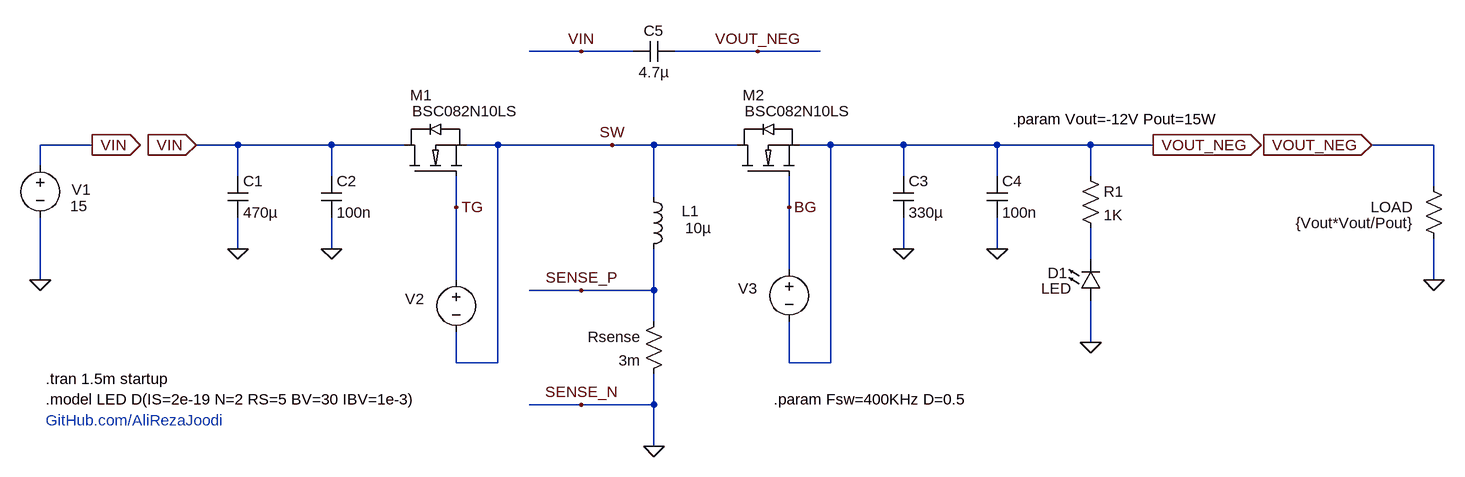
[diagram p0: schematic _PowerStage_v2.0.asc]
_PowerStage_v2.0.asc, the LTspice schematic file:
Version 4.1
SHEET 1 4548 1504
WIRE 3104 176 3024 176
WIRE 3184 176 3104 176
WIRE 3376 176 3248 176
WIRE 3472 176 3376 176
WIRE 2352 320 2272 320
WIRE 2576 320 2512 320
WIRE 2720 320 2576 320
WIRE 2832 320 2720 320
WIRE 2976 320 2928 320
WIRE 3152 320 2976 320
WIRE 3216 320 3152 320
WIRE 3344 320 3216 320
WIRE 3488 320 3440 320
WIRE 3600 320 3488 320
WIRE 3744 320 3600 320
WIRE 3888 320 3744 320
WIRE 3984 320 3888 320
WIRE 4416 320 4320 320
WIRE 2272 352 2272 320
WIRE 2576 368 2576 320
WIRE 2720 368 2720 320
WIRE 3600 368 3600 320
WIRE 3744 368 3744 320
WIRE 3888 368 3888 320
WIRE 4416 384 4416 320
WIRE 3216 400 3216 320
WIRE 2912 416 2912 368
WIRE 3424 416 3424 368
WIRE 2576 480 2576 432
WIRE 2720 480 2720 432
WIRE 3600 480 3600 432
WIRE 3744 480 3744 432
WIRE 3888 496 3888 448
WIRE 3424 512 3424 416
WIRE 2272 528 2272 432
WIRE 2912 528 2912 416
WIRE 4416 528 4416 464
WIRE 3104 544 3024 544
WIRE 3216 544 3216 480
WIRE 3216 544 3104 544
WIRE 3216 592 3216 544
WIRE 3888 624 3888 560
WIRE 2912 656 2912 608
WIRE 2976 656 2976 320
WIRE 2976 656 2912 656
WIRE 3424 656 3424 592
WIRE 3488 656 3488 320
WIRE 3488 656 3424 656
WIRE 3104 720 3024 720
WIRE 3216 720 3216 672
WIRE 3216 720 3104 720
WIRE 3216 784 3216 720
FLAG 3984 320 VOUT_NEG
IOPIN 3984 320 Out
FLAG 2352 320 VIN
IOPIN 2352 320 Out
FLAG 3152 320 SW
FLAG 2912 416 TG
FLAG 3104 544 SENSE_P
FLAG 3104 720 SENSE_N
FLAG 2512 320 VIN
IOPIN 2512 320 In
FLAG 4320 320 VOUT_NEG
IOPIN 4320 320 In
FLAG 3424 416 BG
FLAG 2272 528 0
FLAG 2576 480 0
FLAG 2720 480 0
FLAG 3216 784 0
FLAG 3600 480 0
FLAG 3744 480 0
FLAG 3888 624 0
FLAG 4416 528 0
FLAG 3376 176 VOUT_NEG
FLAG 3104 176 VIN
SYMBOL ind 3200 384 R0
WINDOW 0 59 38 Left 2
WINDOW 3 64 64 Left 2
SYMATTR InstName L1
SYMATTR Value 10µ
SYMATTR SpiceLine Rser=10m
SYMBOL res 3232 576 M0
SYMATTR InstName Rsense
SYMATTR Value 3m
SYMATTR SpiceLine tol=1
SYMBOL voltage 2272 336 R0
WINDOW 123 24 138 Left 2
WINDOW 39 24 117 Left 2
WINDOW 3 46 78 Left 2
WINDOW 0 48 53 Left 2
SYMATTR Value 15
SYMATTR InstName V1
SYMBOL res 4432 480 R180
WINDOW 0 48 64 Left 2
WINDOW 3 48 40 Left 2
SYMATTR InstName LOAD
SYMATTR Value {Vout*Vout/Pout}
SYMBOL cap 2704 368 R0
SYMATTR InstName C2
SYMATTR Value 100n
SYMATTR SpiceLine V=35
SYMBOL cap 3728 368 R0
SYMATTR InstName C4
SYMATTR Value 100n
SYMBOL LED 3872 560 M180
WINDOW 0 -50 43 Left 2
WINDOW 3 -60 19 Left 2
SYMATTR InstName D1
SYMATTR Value LED
SYMBOL res 3872 352 R0
SYMATTR InstName R1
SYMATTR Value 1K
SYMBOL cap 2560 368 R0
SYMATTR InstName C1
SYMATTR Value 470µ
SYMATTR SpiceLine V=35
SYMBOL cap 3584 368 R0
SYMATTR InstName C3
SYMATTR Value 330µ
SYMATTR SpiceLine V=35
SYMBOL MyLib\\Transistor_MOSFET_N\\MOSFET_N 2832 368 R270
WINDOW 0 125 9 VRight 2
WINDOW 3 100 12 VRight 2
SYMATTR InstName M1
SYMATTR Value BSC082N10LS
SYMBOL MyLib\\Transistor_MOSFET_N\\MOSFET_N 3344 368 R270
WINDOW 0 125 9 VRight 2
WINDOW 3 100 12 VRight 2
SYMATTR InstName M2
SYMATTR Value BSC082N10LS
SYMBOL voltage 2912 512 M0
WINDOW 3 39 69 Invisible 2
WINDOW 123 0 0 Left 0
WINDOW 0 49 45 Left 2
SYMATTR Value PULSE(0 12 0 {0.01/Fsw} {0.01/Fsw} {D/Fsw} {1/Fsw})
SYMATTR InstName V2
SYMATTR SpiceLine Rser=10
SYMBOL voltage 3424 496 M0
WINDOW 3 39 69 Invisible 2
WINDOW 123 0 0 Left 0
WINDOW 0 49 45 Left 2
SYMATTR Value PULSE(12 0 0 {0.01/Fsw} {0.01/Fsw} {D/Fsw} {1/Fsw})
SYMATTR InstName V3
SYMATTR SpiceLine Rser=10
SYMBOL cap 3248 160 R90
WINDOW 0 0 32 VBottom 2
WINDOW 3 32 32 VTop 2
SYMATTR InstName C5
SYMATTR Value 4.7µ
TEXT 2280 680 Left 2 !.tran 1.5m startup
TEXT 2280 712 Left 2 !.model LED D(IS=2e-19 N=2 RS=5 BV=30 IBV=1e-3)
TEXT 2280 744 Left 2 ;GitHub.com/AliRezaJoodi
TEXT 3768 280 Left 2 !.param Vout=-12V Pout=15W
TEXT 3400 712 Left 2 !.param Fsw=400KHz D=0.5

The netlist it stands for:
* _PowerStage_v2.0.asc
L1 SW SENSE_P 10µ Rser=10m
Rsense SENSE_P 0 3m tol=1
V1 VIN 0 15
R§LOAD 0 VOUT_NEG {Vout*Vout/Pout}
C2 VIN 0 100n V=35
C4 VOUT_NEG 0 100n
D1 0 N001 LED
R1 VOUT_NEG N001 1K
C1 VIN 0 470µ V=35
C3 VOUT_NEG 0 330µ V=35
M1 VIN TG SW SW BSC082N10LS
M2 SW BG VOUT_NEG VOUT_NEG BSC082N10LS
V2 TG SW PULSE(0 12 0 {0.01/Fsw} {0.01/Fsw} {D/Fsw} {1/Fsw}) Rser=10
V3 BG VOUT_NEG PULSE(12 0 0 {0.01/Fsw} {0.01/Fsw} {D/Fsw} {1/Fsw}) Rser=10
C5 VOUT_NEG VIN 4.7µ
.model D D
.lib standard.dio
.model NMOS NMOS
.model PMOS PMOS
.lib standard.mos
.tran 1.5m startup
.model LED D(IS=2e-19 N=2 RS=5 BV=30 IBV=1e-3)
* GitHub.com/AliRezaJoodi
.param Vout=-12V Pout=15W
.param Fsw=400KHz D=0.5
.backanno
.end